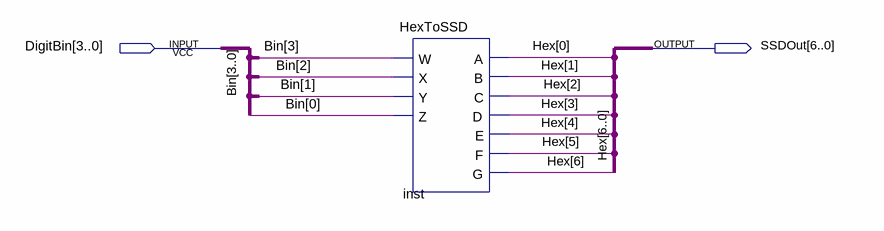
[diagram p0: schematic sheet]
// Quartus schematic HexToSSDBus.bdf as structural Verilog: 1 symbols, 2 pins
module HexToSSDBus (
  input  [3:0] DigitBin,
  output [6:0] SSDOut
);

  HexToSSD inst (
    .W(DigitBin[3]), .X(DigitBin[2]), .Y(DigitBin[1]), .Z(DigitBin[0]), .A(SSDOut[0]), .B(SSDOut[1]),
    .C(SSDOut[2]), .D(SSDOut[3]), .E(SSDOut[4]), .F(SSDOut[5]), .G(SSDOut[6]));

  // Other names for the same wires on the sheet: Bin[3:0] = DigitBin; Hex[6:0] = SSDOut
endmodule
